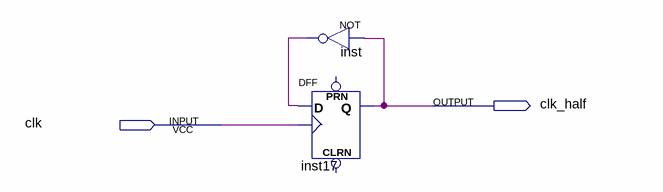
[diagram p0: schematic sheet]
// Quartus schematic half_clock.bdf as structural Verilog: 2 symbols, 2 pins
module half_clock (
  input  clk,
  output clk_half
);

  wire inst_out;

  not inst (inst_out, clk_half);
  DFF inst17 (.CLK(clk), .D(inst_out), .Q(clk_half));  // open: CLRN, PRN
endmodule
